# Altium schematic sheet 3.Relayv2.SchDoc
size A4; PageSetup: Record=PageOptions|CenterHorizontal=True|CenterVertical=True|PrintScale=1.00|XCorrection=1.00|YCorrection=1.00|PrintKind=1|BorderSize=5000000|LeftOffset=0|BottomOffset=0|Orientation=2|PaperLength=1000|PaperWidth=1000|Scale=100|PaperSource=15|PrintQuality=1200|MediaType=1|DitherType=10|PrintScaleMode=1|PaperKind=A4|PaperIndex=9
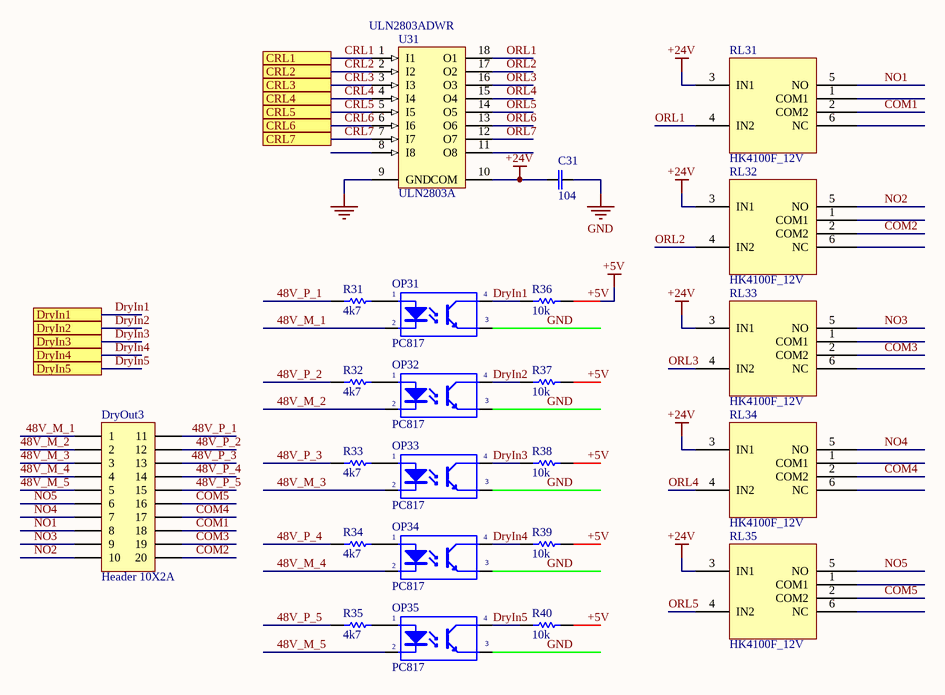
[diagram p0: 3.Relayv2.SchDoc]

## Parts
C31  value 104  [CAP 0805]  (hidden comment: Tụ điện dán 0805104)
DryOut3  Header 10X2A  [HDR2X10_CEN]
OP31  PC817  [DIP4/W0.3]
OP32  PC817  [DIP4/W0.3]
OP33  PC817  [DIP4/W0.3]
OP34  PC817  [DIP4/W0.3]
OP35  PC817  [DIP4/W0.3]
R31  value 4k7  [RESC3216N]  (hidden comment: Điện trở dán 12064k7)
R32  value 4k7  [RESC3216N]  (hidden comment: Điện trở dán 12064k7)
R33  value 4k7  [RESC3216N]  (hidden comment: Điện trở dán 12064k7)
R34  value 4k7  [RESC3216N]  (hidden comment: Điện trở dán 12064k7)
R35  value 4k7  [RESC3216N]  (hidden comment: Điện trở dán 12064k7)
R36  value 10k  [RES 0805]  (hidden comment: Điện trở dán 080510k)
R37  value 10k  [RES 0805]  (hidden comment: Điện trở dán 080510k)
R38  value 10k  [RES 0805]  (hidden comment: Điện trở dán 080510k)
R39  value 10k  [RES 0805]  (hidden comment: Điện trở dán 080510k)
R40  value 10k  [RES 0805]  (hidden comment: Điện trở dán 080510k)
RL31  HK4100F_12V  [HK4100F]
RL32  HK4100F_12V  [HK4100F]
RL33  HK4100F_12V  [HK4100F]
RL34  HK4100F_12V  [HK4100F]
RL35  HK4100F_12V  [HK4100F]
U31  ULN2803A  Supplier Part Number 1: ULN2803ADWR  [SOIC-18]

## Ports
CRL1, CRL2, CRL3, CRL4, CRL5, CRL6, CRL7, DryIn1, DryIn2, DryIn3, DryIn4, DryIn5

## Nets
+5V: R36.2 R37.2 R38.2 R39.2 R40.2
+24V: C31.2 RL31.3(IN1) RL32.3(IN1) RL33.3(IN1) RL34.3(IN1) RL35.3(IN1) U31.10(COM)
GND: C31.1 OP31.3(E) OP32.3(E) OP33.3(E) OP34.3(E) OP35.3(E) U31.9(GND)
48V_M_1: DryOut3.1 OP31.2(K)
48V_M_2: DryOut3.2 OP32.2(K)
48V_M_3: DryOut3.3 OP33.2(K)
48V_M_4: DryOut3.4 OP34.2(K)
48V_M_5: DryOut3.5 OP35.2(K)
48V_P_1: DryOut3.11 R31.1
48V_P_2: DryOut3.12 R32.1
48V_P_3: DryOut3.13 R33.1
48V_P_4: DryOut3.14 R34.1
48V_P_5: DryOut3.15 R35.1
COM1: DryOut3.18 RL31.2(COM2)
COM2: DryOut3.20 RL32.2(COM2)
COM3: DryOut3.19 RL33.2(COM2)
COM4: DryOut3.17 RL34.2(COM2)
COM5: DryOut3.16 RL35.2(COM2)
CRL1: U31.1(I1) ; port CRL1
CRL2: U31.2(I2) ; port CRL2
CRL3: U31.3(I3) ; port CRL3
CRL4: U31.4(I4) ; port CRL4
CRL5: U31.5(I5) ; port CRL5
CRL6: U31.6(I6) ; port CRL6
CRL7: U31.7(I7) ; port CRL7
DryIn1: OP31.4(C) R36.1 ; port DryIn1
DryIn2: OP32.4(C) R37.1 ; port DryIn2
DryIn3: OP33.4(C) R38.1 ; port DryIn3
DryIn4: OP34.4(C) R39.1 ; port DryIn4
DryIn5: OP35.4(C) R40.1 ; port DryIn5
NO1: DryOut3.8 RL31.5(NO)
NO2: DryOut3.10 RL32.5(NO)
NO3: DryOut3.9 RL33.5(NO)
NO4: DryOut3.7 RL34.5(NO)
NO5: DryOut3.6 RL35.5(NO)
ORL1: RL31.4(IN2) U31.18(O1)
ORL2: RL32.4(IN2) U31.17(O2)
ORL3: RL33.4(IN2) U31.16(O3)
ORL4: RL34.4(IN2) U31.15(O4)
ORL5: RL35.4(IN2) U31.14(O5)
ORL6: U31.13(O6)
ORL7: U31.12(O7)
NetOP31_1: OP31.1(A) R31.2
NetOP32_1: OP32.1(A) R32.2
NetOP33_1: OP33.1(A) R33.2
NetOP34_1: OP34.1(A) R34.2
NetOP35_1: OP35.1(A) R35.2

Not connected (* = marked no-connect by the designer): RL31 1(COM1) 6(NC); RL32 1(COM1) 6(NC); RL33 1(COM1) 6(NC); RL34 1(COM1) 6(NC); RL35 1(COM1) 6(NC); U31 8(I8) 11(O8)

## Library data of the parts
C31 = CAP NP: Capacitor non polarized; cm1: Tụ điện dán 0603; cm3: Tụ điện dán 1206; cm2: Tụ điện dán 0805
DryOut3 = Header 10X2A: Header, 10-Pin, Dual row; LatestRevisionDate: 17-Jul-2002; LatestRevisionNote: Re-released for DXP Platform.; Publisher: Altium Limited
OP31-OP35 = PC817: Single Opto; Value: PC817
R31-R35 = Res: Resistor; cm1: Điện trở dán 0603; cm2: Điện trở cắm 1/4W; cm3: Điện trở dán 0805; cm4: Điện trở dán 1206
R36-R40 = Res: Resistor; cm1: Điện trở dán 0603; cm2: Điện trở cắm 1/4W; cm4: Điện trở dán 1206; cm3: Điện trở dán 0805
RL31-RL35 = HK4100F
U31 = ULN2803A: High-Voltage, High-Current Darlington Array; Manufacturer: Texas Instruments; Description: TEXAS INSTRUMENTS   ULN2803ADWR..   Bipolar Transistor Array, Darlington, NPN, 50 V, 500 mA, SOIC; Polarity: NPN; Collector Emitter Voltage (VCEO): 50V; Number of Elements: 8; Collector Emitter Saturation Voltage: 1.1V; Max Collector Current: 500mA; LatestRevisionNote: Stylized 3D Model Added.; Publisher: Altium Limited; Value: ULN2803A; Supplier 1: Arrow; Manufacturer Part Number: ULN2803ADWR; Stock 1: 6620; Pricing 1: 2000=0.5499, 10000=0.5312, 1=0.5547, 2001=0.509 (USD); Mount: Surface Mount; Case/Package: SOIC; Number of Pins: 18; Contact Plating: Gold; Min Operating Temperature: -65°C; Max Operating Temperature: 150°C; Collector Emitter Breakdown Voltage: 50V; Packaging: Tape and Reel; Package Quantity: 1; Number of Drivers: 8; Voltage Rating (DC): 50V; Current Rating: 500mA; Length: 11.62mm; Height: 2.35mm; Width: 7.52mm; Radiation Hardening: No; Lead Free: Lead Free; REACH SVHC: No SVHC; ComponentLink1URL: http://www.ti.com/general/docs/lit/getliterature.tsp?genericPartNumber=ULN2803A&amp;&amp;fileType=pdf; ComponentLink1Description: http://www.ti.com/general/docs/lit/getliterature.tsp?genericPartNumber=ULN2803A&amp;&amp;fileType=pdf; ComponentLink2URL: https://www.verical.com/server-webapp/html/getDatasheet?partID=134747; ComponentLink2Description: https://www.verical.com/server-webapp/html/getDatasheet?partID=134747; ComponentLink3URL: http://www.farnell.com/datasheets/1992213.pdf; ComponentLink3Description: http://www.farnell.com/datasheets/1992213.pdf; ComponentLink4URL: http://www.jameco.com/Jameco/Products/ProdDS/1927351.pdf; ComponentLink4Description: http://www.jameco.com/Jameco/Products/ProdDS/1927351.pdf; ComponentLink5URL: http://www.ti.com/lit/ds/symlink/uln2803a.pdf; ComponentLink5Description: http://www.ti.com/lit/ds/symlink/uln2803a.pdf; ComponentLink6URL: http://www.farnell.com/datasheets/1887697.pdf; ComponentLink6Description: http://www.farnell.com/datasheets/1887697.pdf; ComponentLink7URL: http://www.farnell.com/datasheets/2020638.pdf; ComponentLink7Description: http://www.farnell.com/datasheets/2020638.pdf